# Altium schematic sheet 14_Misc3.SchDoc: Power
size A3; Organization: Lime Microsystems; Address1: Surrey Tech Centre; Address2: Guildford GU2 7YG; Address3: Surrey; Address4: United Kingdom; Revision: v1.1; SheetNumber: 12; SheetTotal: 12
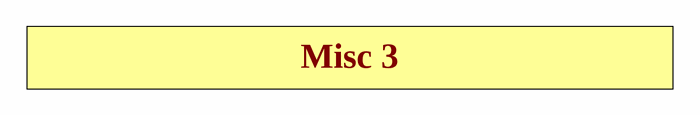
[diagram p0: 14_Misc3.SchDoc]

## Notes on the sheet
- Misc 3
- Project name:
- Title:
- Size:
- Date:
- A3
- Revision:
- Time:
- Sheet
- of
- File: